# Altium schematic sheet dali_phy_blk.SchDoc
size A4; Engineer: JBayalas; DocumentNumber: 4; Revision: V1.0; SheetNumber: 4; SheetTotal: 11; Rule: PcbType=ProtelPcb
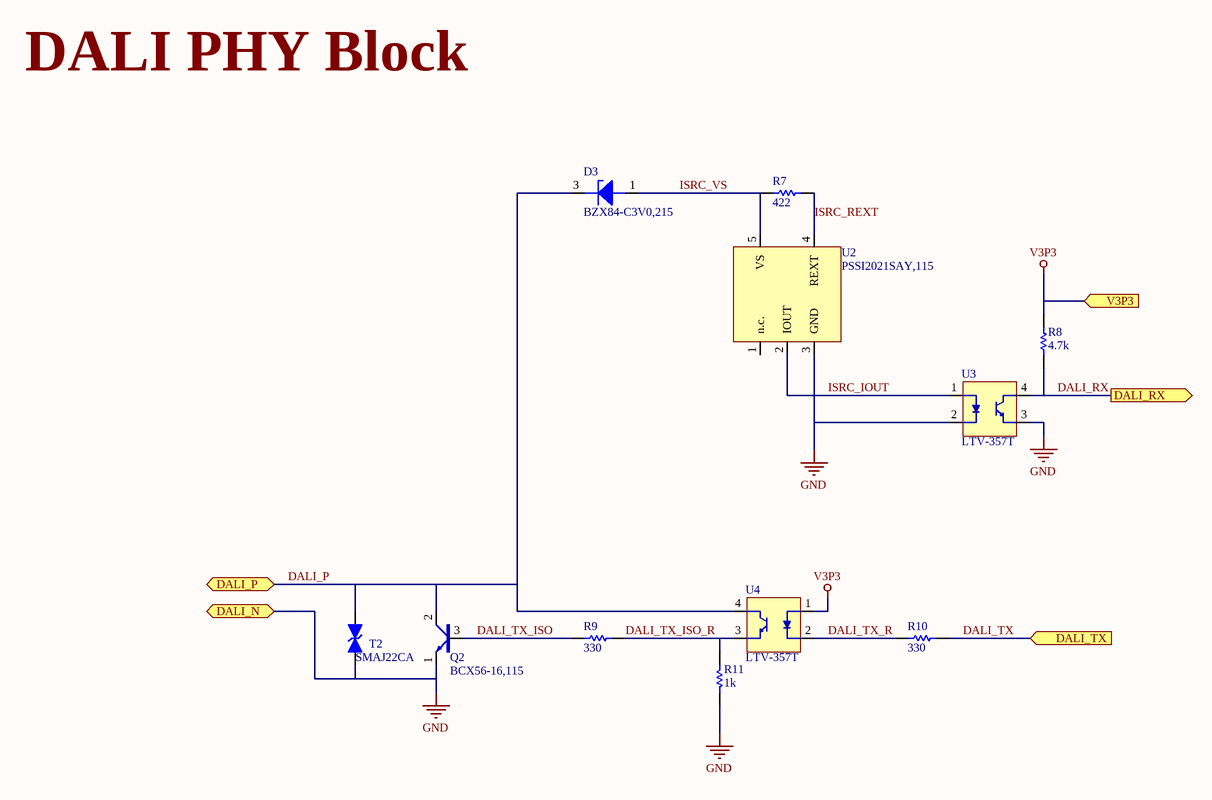
[diagram p0: dali_phy_blk.SchDoc]

## Parts
D3  BZX84-C3V0,215  [SOT-23(TO-236AB)]
Q2  BCX56-16,115  [SOT 89-3]
R7  value 422  [R0402]  (hidden comment: ERJ-2RKF4220X)
R8  value 4.7k  [R0402]  (hidden comment: RT0402FRE074K7L)
R9  value 330  [R0402]  (hidden comment: CRCW0402330RFKED)
R10  value 330  [R0402]  (hidden comment: CRCW0402330RFKED)
R11  value 1k  [R0402]  (hidden comment: MCS04020C1001FE000)
T2  SMAJ22CA  [DO-214AC]
U2  PSSI2021SAY,115  [SOT353]
U3  LTV-357T  [4SMD(gull wing)]
U4  LTV-357T  [4SMD(gull wing)]

## Ports
DALI_N (bidir), DALI_P (bidir), DALI_RX (out), DALI_TX (in), V3P3 (in)

## Nets
GND: Q2.1(emitter) R11.1 T2.2(K) U2.3(GND) U3.2(Cathode) U3.3(Emitter) ; port DALI_N
V3P3: R8.2 U4.1(Anode) ; port V3P3
DALI_P: D3.3(K) Q2.2(collector) T2.1(A) U4.4(Collector) ; port DALI_P
DALI_RX: R8.1 U3.4(Collector) ; port DALI_RX
DALI_TX: R10.2 ; port DALI_TX
DALI_TX_ISO: Q2.3(base) R9.1
DALI_TX_ISO_R: R9.2 R11.2 U4.3(Emitter)
DALI_TX_R: R10.1 U4.2(Cathode)
ISRC_IOUT: U2.2(IOUT) U3.1(Anode)
ISRC_REXT: R7.2 U2.4(REXT)
ISRC_VS: D3.1(A) R7.1 U2.5(VS)

Not connected (* = marked no-connect by the designer): U2 1(n.c.)

## Notes on the sheet
- DALI PHY Block
- Title:
- Sheet:
- Date:
- of
- Project:
- Revision:
- Engineer:
- Wi4B S.r.l

## Library data of the parts
D3 = BZX84-C3V0,215: DIODE ZENER 3V 250MW TO236AB; Manufacturer: NXP Semiconductors; Tolerance: ±5%; Impedance (Max) (Zzt): 95 Ohm; Current - Reverse Leakage @ Vr: 10µA @ 1V; Voltage - Forward (Vf) (Max) @ If: 900mV @ 10mA; Supplier 1: Digi-Key; RoHS: RoHS Compliant; Category: Discrete Semiconductor Products; Stock 1: 18717; Pricing 1: 1=0.16, 10=0.149, 25=0.1352, 100=0.0973, 250=0.05732, 500=0.04756, 1000=0.03245 (USD); Packaging: Cut Tape (CT); Voltage - Zener (Nom) (Vz): 3V; Power - Max: 250mW; Operating Temperature: -65°C ~ 150°C; Mounting Type: Surface Mount; Package / Case: TO-236-3, SC-59, SOT-23-3; Supplier Device Package: SOT-23 (TO-236AB); ComponentLink1URL: http://www.nxp.com/documents/data_sheet/BZX84_SER.pdf; ComponentLink1Description: http://www.nxp.com/documents/data_sheet/BZX84_SER.pdf; Supplier Part Number 1: 568-6326-1-ND; Manufacturer Part Number: BZX84-C3V0,215
Q2 = BCX56-16,115: TRANS NPN MED 1A 80V SOT89; Manufacturer: NXP Semiconductors; Vce Saturation (Max) @ Ib, Ic: 500mV @ 50mA, 500mA; DC Current Gain (hFE) (Min) @ Ic, Vce: 100 @ 150mA, 2V; Power - Max: 1.25W; Frequency - Transition: 180MHz; Supplier 1: Digi-Key; RoHS: RoHS Compliant; Category: Discrete Semiconductor Products; Stock 1: 23673; Pricing 1: 1=0.58, 10=0.406, 25=0.3332, 100=0.2664, 250=0.19404, 500=0.15758 (USD); Packaging: Cut Tape (CT); Transistor Type: NPN; Current - Collector (Ic) (Max): 1A; Voltage - Collector Emitter Breakdown (Max): 80V; Current - Collector Cutoff (Max): -; Mounting Type: Surface Mount; Package / Case: TO-243AA; Supplier Device Package: SOT-89-3; ComponentLink1URL: http://media.digikey.com/pdf/Data%20Sheets/NXP%20PDFs/BC639,BCP56,BCX56.pdf; ComponentLink1Description: http://media.digikey.com/pdf/Data%20Sheets/NXP%20PDFs/BC639,BCP56,BCX56.pdf; Supplier Part Number 1: 568-1642-1-ND; Manufacturer Part Number: BCX56-16,115
R7 = ERJ-2RKF4220X: RES SMD 422 OHM 1% 1/10W 0402; MFT: Panasonic Electronic Components; MPN: ERJ-2RKF4220X; TYPE: SMD; LOAD: *; RATING: 1/10W; APN: *
R8 = RT0402FRE074K7L: RES SMD 4.7K OHM 1% 1/16W 0402; MFT: Yageo; MPN: RT0402FRE074K7L; TYPE: SMD; LOAD: *; RATING: 1/16W; APN: *
R9 R10 = CRCW0402330RFKED: RES SMD 330 OHM 1% 1/16W 0402; MFT: Vishay Dale; MPN: CRCW0402330RFKED; TYPE: SMD; RATING: 1/16W; DNP: *
R11 = MCS04020C1001FE000: RES SMD 1K OHM 1% 1/10W 0402; MFT: Vishay Beyschlag; MPN: MCS04020C1001FE000; TYPE: SMD; RATING: 1/10W; DNP: *
T2 = SMAJ22CA: TVS Diodes - Transient Voltage Suppressors 22Vr 400W 11.3A 5% BiDirectional; MFT: Littelfuse; TYPE: SMD/SMT; RATING: 22 V; VALUE: SMAJ22CA; MPN: SMAJ22CA
U2 = PSSI2021SAY,115: NXP - PSSI2021SAY,115 - IC, CURRENT REGULATOR, 75V, 50MA, 5-SOT-353, FULL REEL; Power Dissipation Pd: 335; No. of Pins: 5; Supplier 1: Newark; Manufacturer: NXP; RoHS: YES; Stock 1: 3000; Pricing 1: 3000=0.233, 6000=0.216, 15000=0.209, 30000=0.201, 75000=0.197, 150000=0.192 (USD); Forward Current If: -; Forward Voltage: -; Forward Current If(AV): -; Current Regulator Case Style: SOT-353; Packaging: Tape & Reel; ComponentLink1URL: http://www.farnell.com/datasheets/667515.pdf; ComponentLink1Description: http://www.farnell.com/datasheets/667515.pdf; Supplier Part Number 1: 70R7980; Manufacturer Part Number: PSSI2021SAY,115
U3 U4 = LTV-357T: OPTOISOLATOR 3.75KV TRANS 4-SOP; MFT: Lite-On Inc.; TYPE: SMD; RATING: 3.75KV; VALUE: LTV-357T; LOAD: *; MPN: LTV-357T